# EAGLE design RaspiRobotBoardSMD (EAGLE 6.3)
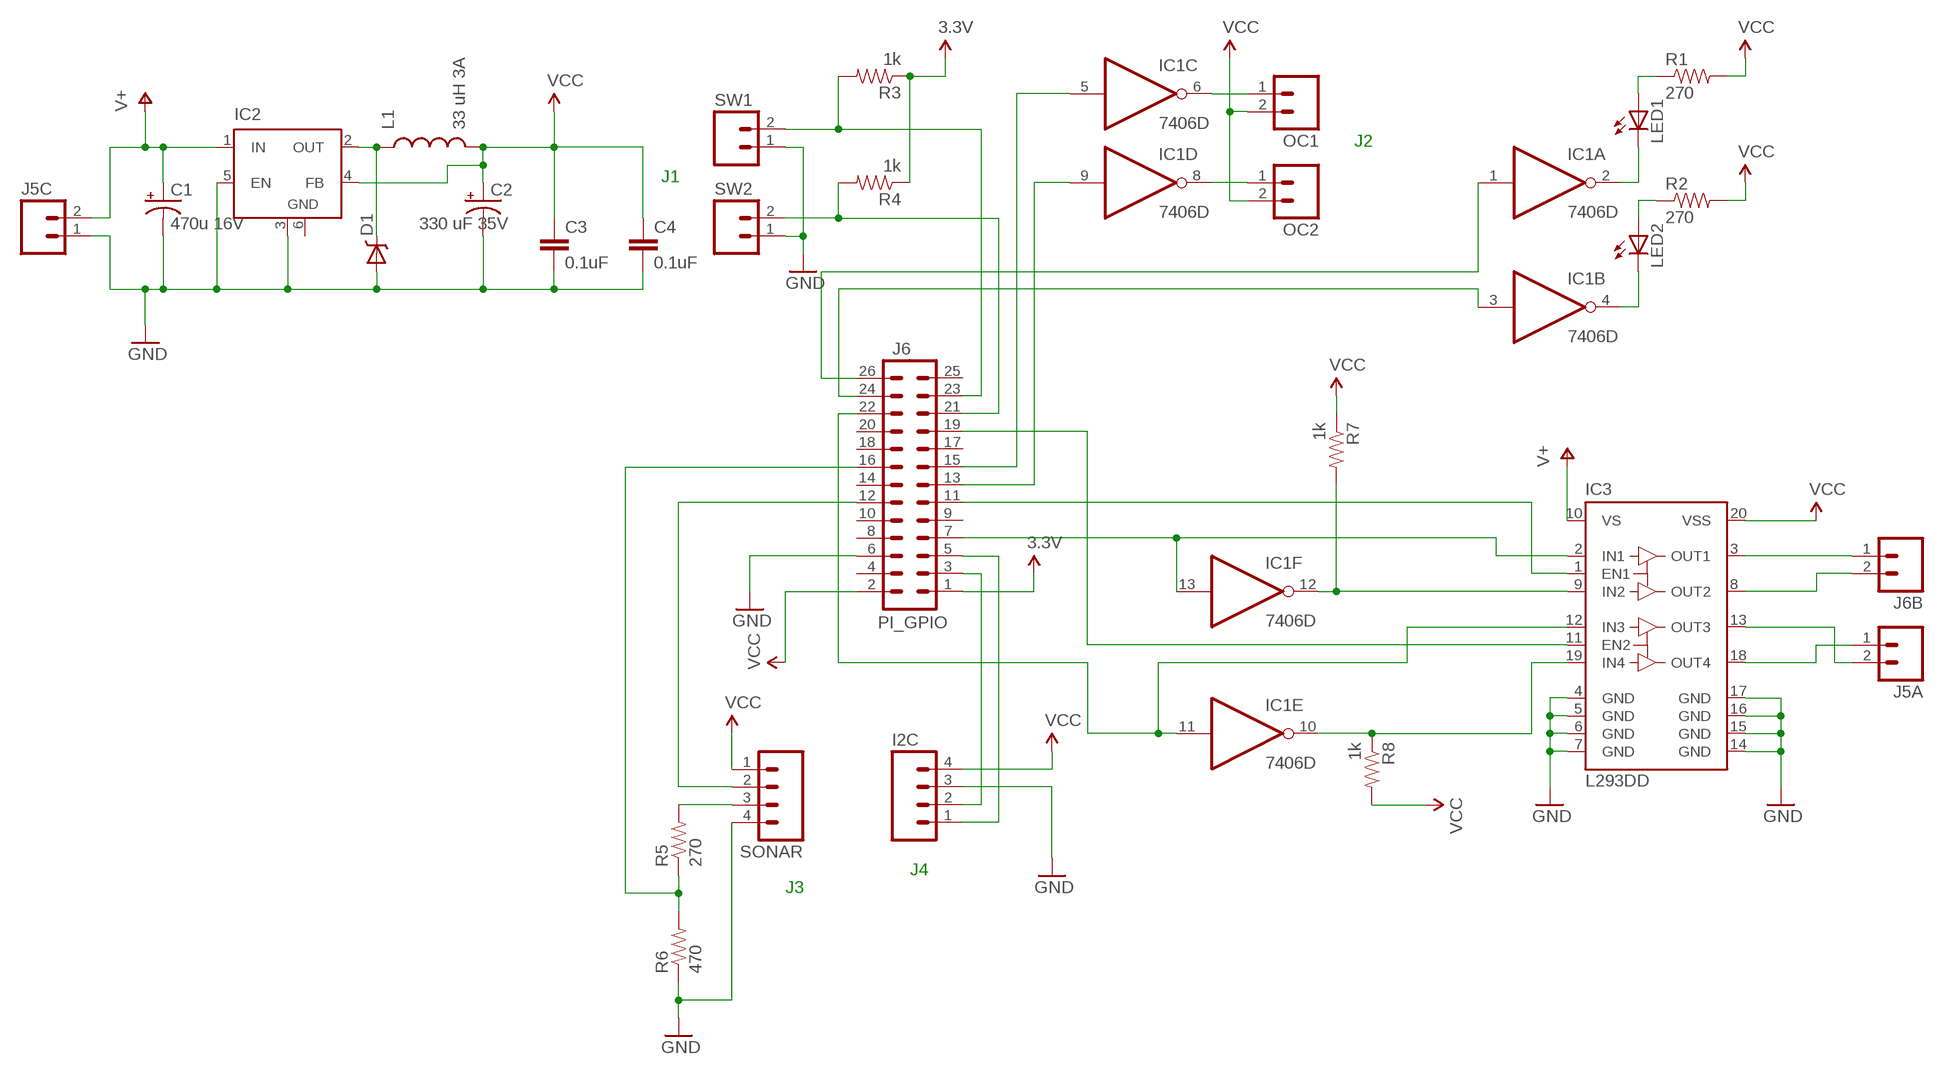
[diagram p0: schematic, sheet 1]

## Parts
C1  470u 16V  CAP_POLE  [PANASONIC_E]
C2  330 uF 35V  CAP_POLG  [PANASONIC_G]
C3  0.1uF  CAP0805  [0805]
C4  0.1uF  CAP0805  [0805]
D1  B340A  [SMA-DIODE]
I2C  M04PTH  [1X04]
IC1  7406D  [SO14]
IC2  LM2596S  [TO263-5]
IC3  L293DD  [SO20]
J5A  M023.5MM_LOCK  [SCREWTERMINAL-3.5MM-2_LOCK]
J5C  M023.5MM_LOCK  [SCREWTERMINAL-3.5MM-2_LOCK]
J6  M13X22X13  [2X13]
J6B  M023.5MM_LOCK  [SCREWTERMINAL-3.5MM-2_LOCK]
L1  33 uH 3A  INDUCTORPWR  [CDRH125]
LED1  LEDSMT1206  [1206]
LED2  LEDSMT1206  [1206]
OC1  M02PTH  [1X02]
OC2  M02PTH  [1X02]
R1  270  RESISTOR0805-RES  [0805]
R2  270  RESISTOR0805-RES  [0805]
R3  1k  RESISTOR0805-RES  [0805]
R4  1k  RESISTOR0805-RES  [0805]
R5  270  RESISTOR0805-RES  [0805]
R6  470  RESISTOR0805-RES  [0805]
R7  1k  RESISTOR0805-RES  [0805]
R8  1k  RESISTOR0805-RES  [0805]
SONAR  M04PTH  [1X04]
SW1  M02PTH  [1X02]
SW2  M02PTH  [1X02]

## Nets
3.3V: J6.1 R3.1 R4.1
GND [power]: C1.- C2.- C3.2 C4.2 D1.A I2C.3 IC2.3(GND) IC2.5(EN) IC3.4(GND) IC3.5(GND) IC3.6(GND) IC3.7(GND) IC3.14(GND) IC3.15(GND) IC3.16(GND) IC3.17(GND) J5C.1 J6.6 R6.1 SONAR.4 SW1.1 SW2.1
N$1: D1.C IC2.2(OUT) L1.1
N$2: IC3.3(OUT1) J6B.1
N$3: IC3.8(OUT2) J6B.2
N$4: IC3.18(OUT4) J5A.1
N$5: IC1.13(F:I) IC3.2(IN1) J6.7
N$6: IC1.12(F:O) IC3.9(IN2) R7.2
N$7: IC1.10(E:O) IC3.19(IN4) R8.1
N$8: IC1.11(E:I) IC3.12(IN3) J6.22
N$9: LED1.A R1.1
N$10: LED2.A R2.1
N$11: IC1.2(A:O) LED1.C
N$12: IC1.4(B:O) LED2.C
N$13: IC1.6(C:O) OC1.1
N$14: IC1.8(D:O) OC2.1
N$15: J6.23 R3.2 SW1.2
N$16: J6.21 R4.2 SW2.2
N$17: IC1.3(B:I) J6.24
N$18: J6.16 R5.1 R6.2
N$19: J6.12 SONAR.2
N$20: R5.2 SONAR.3
N$21: IC1.1(A:I) J6.26
N$22: IC3.1(EN1) J6.11
N$23: IC3.11(EN2) J6.19
N$24: IC1.9(D:I) J6.13
N$25: IC1.5(C:I) J6.15
N$26: I2C.2 J6.3
N$27: I2C.1 J6.5
N$28: IC3.13(OUT3) J5A.2
V+: C1.+ IC2.1(IN) IC3.10(VS) J5C.2
VCC: C2.+ C3.1 C4.1 I2C.4 IC2.4(FB) IC3.20(VSS) J6.2 L1.2 OC1.2 OC2.2 R1.2 R2.2 R7.1 R8.2 SONAR.1
Unconnected: J6.4 J6.8 J6.9 J6.10 J6.14 J6.17 J6.18 J6.20 J6.25

## Notes on the sheet
- J2
- J1
- PI_GPIO
- J4
- J3

## Power pins joined to a net without a drawn wire
GND: IC1.7(P:GND) IC2.6(GND)
VCC: IC1.14(P:VCC)

## Library data of the parts
C1 = MyParts:CAP_POL: Capacitor Polarized These are standard SMD and PTH capacitors. Normally 10uF, 47uF, and 100uF in electrolytic and tantalum varieties. Always verify the external diameter of the through hole cap, it varies with capacity, voltage, and manufacturer. The EIA devices should be standard.
C2 = SparkFun-Capacitors:CAP_POL: Capacitor Polarized These are standard SMD and PTH capacitors. Normally 10uF, 47uF, and 100uF in electrolytic and tantalum varieties. Always verify the external diameter of the through hole cap, it varies with capacity, voltage, and manufacturer. The EIA devices should be standard.
C3 C4 = SparkFun-Capacitors:CAP: Capacitor Standard 0603 ceramic capacitor, and 0.1" leaded capacitor.
D1 = SparkFun-DiscreteSemi:B340A: Schottky Diode 3A-40V; PROD_ID: DIO-09886
I2C SONAR = SparkFun-Connectors:M04: Header 4 Standard 4-pin 0.1" header. Use with straight break away headers (SKU : PRT-00116), right angle break away headers (PRT-00553), swiss pins (PRT-00743), machine pins (PRT-00117), and female headers (PRT-00115). Molex polarized connector foot print use with SKU : PRT-08231 with associated crimp pins and housings. 1MM SMD Version SKU: PRT-10208
IC1 = 74xx-eu:74*06: Hex INVERTER, open collector high-voltage output
IC2 = MyParts:LM2596S: STEP-DOWN VOLTAGE REGULATOR
IC3 = st-microelectronics:L293DD: PUSH-PULL FOUR CHANNEL DRIVER WITH DIODES Source: http://www.st.com/stonline/books/pdf/docs/1330.pdf; OC_FARNELL: unknown
J5A J5C J6B OC1 OC2 SW1 SW2 = SparkFun-Connectors:M02: Header 2 Standard 2-pin 0.1" header. Use with straight break away headers (SKU : PRT-00116), right angle break away headers (PRT-00553), swiss pins (PRT-00743), machine pins (PRT-00117), and female headers (PRT-00115). Molex polarized connector foot print use with SKU : PRT-08233 with associated crimp pins and housings.
J6 = SparkFun-Connectors:M13X2
L1 = SparkFun-Passives:INDUCTOR: Inductors Basic Inductor/Choke - 0603 and 1206. Footprints are not proven and vary greatly between part numbers.
LED1 LED2 = led:LED: LED OSRAM: - CHIPLED LG R971, LG N971, LY N971, LG Q971, LY Q971, LO R971, LY R971 LH N974, LH R974 LS Q976, LO Q976, LY Q976 LO Q996 - Hyper CHIPLED LW Q18S LB Q993, LB Q99A, LB R99A - SideLED LS A670, LO A670, LY A670, LG A670, LP A670 LB A673, LV A673, LT A673, LW A673 LH A674 LY A675 LS A676, LA A676, LO A676, LY A676, LW A676 LS A679, LY A679, LG A679 - Hyper Micro SIDELED® LS Y876, LA Y876, LO Y876, LY Y876 LT Y87S - SmartLED LW L88C, LW L88S LB L89C, LB L89S, LG L890 LS L89K, LO L89K, LY L89K LS L896, LA L896, LO L896, LY L896 - TOPLED LS T670, LO T670, LY T670, LG T670, LP T670 LSG T670, LSP T670, LSY T670, LOP T670, LYG T670 LG T671, LOG T671, LSG T671 LB T673, LV T673, LT T673, LW T673 LH T674 LS T676, LA T676, LO T676, LY T676, LB T676, LH T676, LSB T676, LW T676 LB T67C, LV T67C, LT T67C, LS T67K, LO T67K, LY T67K, LW E67C LS E67B, LA E67B, LO E67B, LY E67B, LB E67C, LV E67C, LT E67C LW T67C LS T679, LY T679, LG T679 LS T770, LO T770, LY T770, LG T770, LP T770 LB T773, LV T773, LT T773, LW T773 LH T774 LS E675, LA E675, LY E675, LS T675 LS T776, LA T776, LO T776, LY T776, LB T776 LHGB T686 LT T68C, LB T68C - Hyper Mini TOPLED® LB M676 - Mini TOPLED Santana® LG M470 LS M47K, LO M47K, LY M47K Source: http://www.osram.convergy.de LUXEON: - LUMILED® LXK2-PW12-R00, LXK2-PW12-S00, LXK2-PW14-U00, LXK2-PW14-V00 LXK2-PM12-R00, LXK2-PM12-S00, LXK2-PM14-U00 LXK2-PE12-Q00, LXK2-PE12-R00, LXK2-PE12-S00, LXK2-PE14-T00, LXK2-PE14-U00 LXK2-PB12-K00, LXK2-PB12-L00, LXK2-PB12-M00, LXK2-PB14-N00, LXK2-PB14-P00, LXK2-PB14-Q00 LXK2-PR12-L00, LXK2-PR12-M00, LXK2-PR14-Q00, LXK2-PR14-R00 LXK2-PD12-Q00, LXK2-PD12-R00, LXK2-PD12-S00 LXK2-PH12-R00, LXK2-PH12-S00 LXK2-PL12-P00, LXK2-PL12-Q00, LXK2-PL12-R00 Source: www.luxeon.com KINGBRIGHT: KA-3528ASYC Source: www.kingbright.com
R1-R8 = SparkFun-Resistors:RESISTOR: Resistor Basic schematic elements and footprints for 0603, 1206, and PTH resistors.

## Net classes
0 default: width 0.305 mm
1 power: width 0.305 mm

## Board
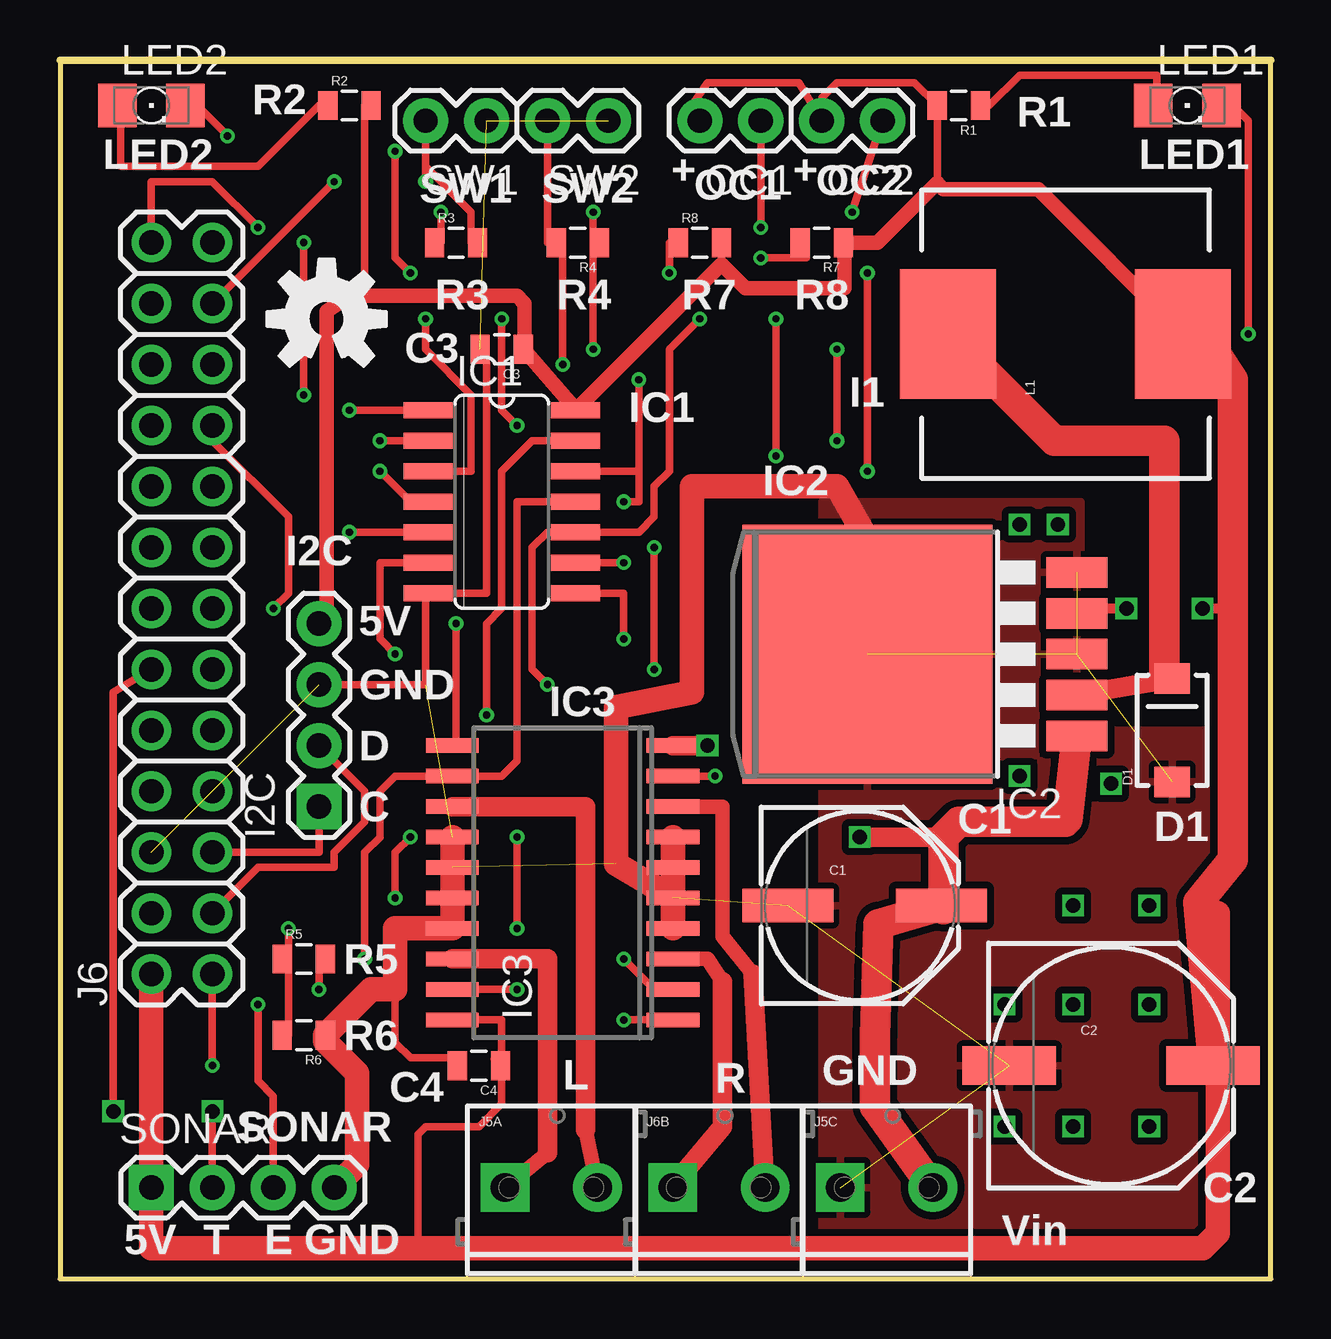
[diagram p1: board, top side]
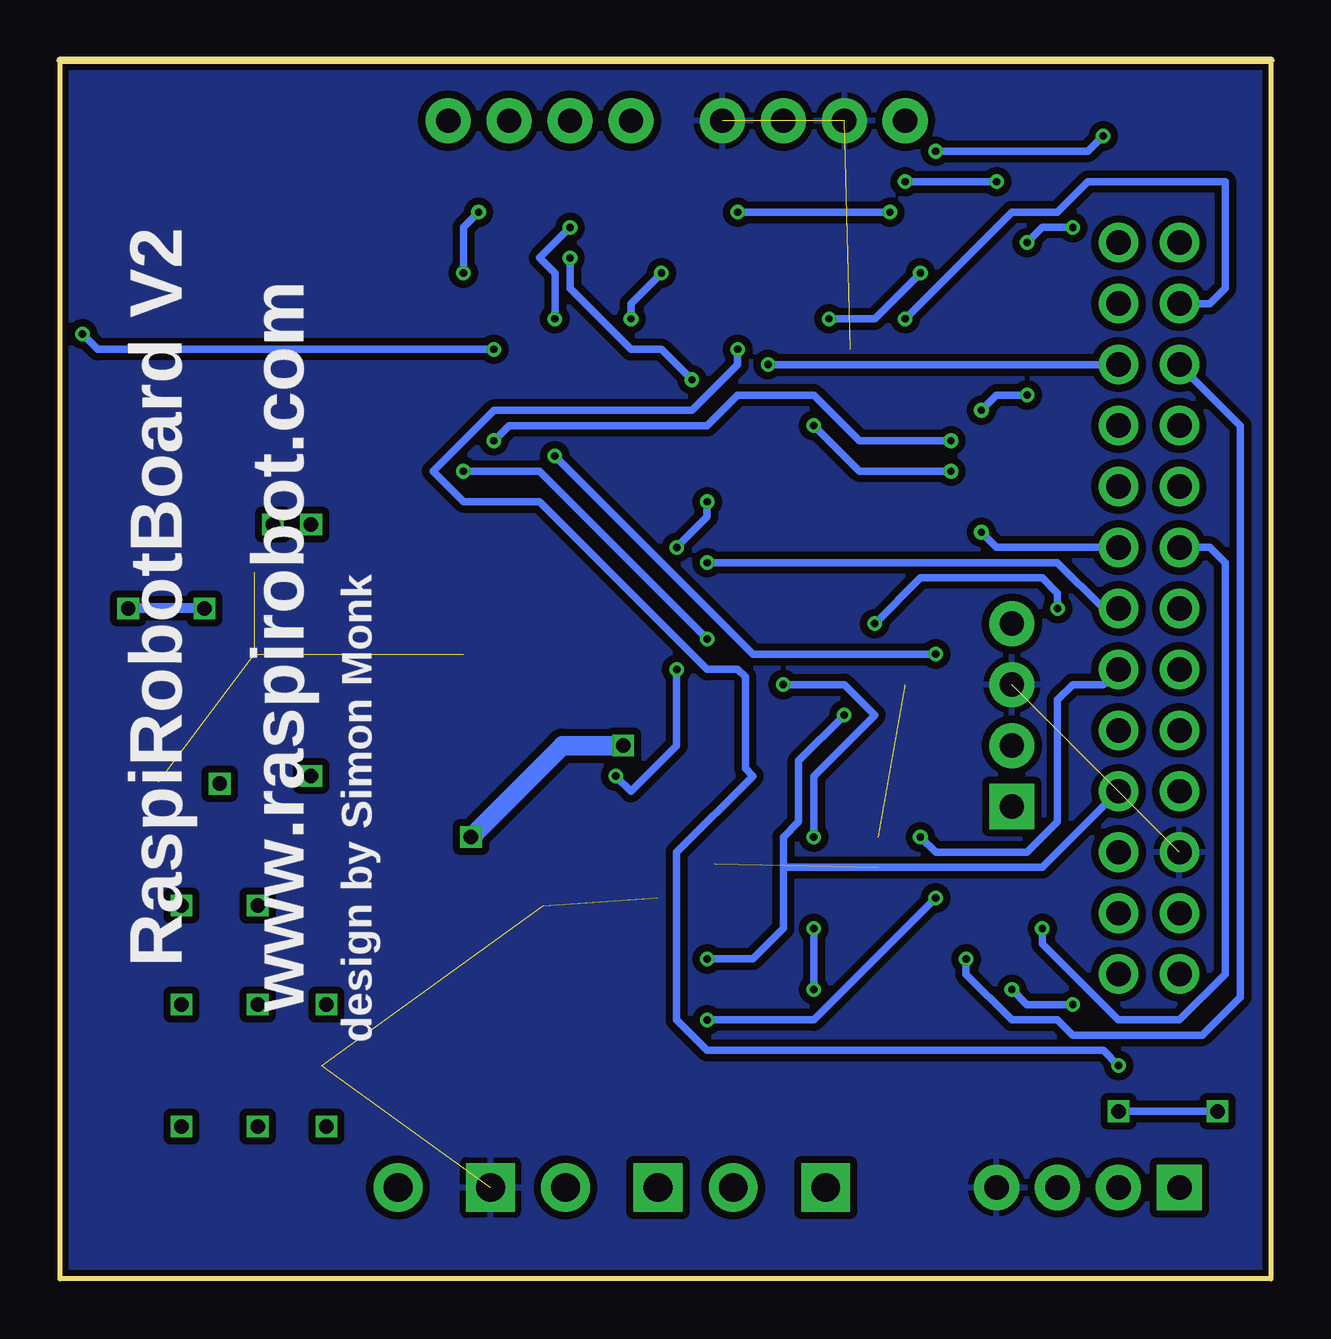
[diagram p2: board, bottom side, seen from below]

Size 50.47 x 50.79 mm. Coordinates in mm from the lower left corner, seen from the top.
Outline: 0,0 50.47,0 50.47,50.79 0,50.79 0,0
Copper layers (1*16): Top 0.035mm / dielectric 1.5mm / Bottom 0.035mm
Design rules "default": minimum track width 8mil, minimum drill 12mil, track to track 12mil, track to pad 12mil, pad to pad 12mil, via to via 12mil, smd to smd 0mil, copper to edge 10mil, drill to drill 10mil, minimum pad ring 10mil, minimum via ring 6mil, stop-mask expansion 2mil, vias tented up to drill 100mil, thermal gap 10mil

### Footprints (pad centres in the part's own frame; a part is rotated, then mirrored left to right if it is on the bottom)
PANASONIC_E = smd 3.8 x 1.4: + 3.4,0; - -3,0
PANASONIC_G = smd 3.9 x 1.6: + 4.25,0; - -4.25,0
0805 = smd 0.8 x 1.2: 1 -0.9,0; 2 0.9,0
SMA-DIODE = smd 1.27 x 1.47: A -2.15,0; C 2.15,0
1X04 = drill 1.016 pad 1.88 square: 1 0,0 | drill 1.016 pad 1.88: 2 2.54,0; 3 5.08,0; 4 7.62,0
SO14 = smd 0.66 x 2.032: 1 -3.81,-3.073; 2 -2.54,-3.073; 3 -1.27,-3.073; 4 0,-3.073; 5 1.27,-3.073; 6 2.54,-3.073; 7 3.81,-3.073; 8 3.81,3.073; 9 2.54,3.073; 10 1.27,3.073; 11 0,3.073; 12 -1.27,3.073; 13 -2.54,3.073; 14 -3.81,3.073
TO263-5 = smd 1.27 x 2.54: 1 -3.404,-6.191; 2 -1.702,-6.191; 3 0,-6.191; 4 1.702,-6.191; 5 3.404,-6.191 | smd 10.8 x 10.41: 6 0,2.54
SO20 = smd 0.6 x 2.2: 1 -5.715,-4.6; 2 -4.445,-4.6; 3 -3.175,-4.6; 4 -1.905,-4.6; 5 -0.635,-4.6; 6 0.635,-4.6; 7 1.905,-4.6; 8 3.175,-4.6; 9 4.445,-4.6; 10 5.715,-4.6; 11 5.715,4.6; 12 4.445,4.6; 13 3.175,4.6; 14 1.905,4.6; 15 0.635,4.6; 16 -0.635,4.6; 17 -1.905,4.6; 18 -3.175,4.6; 19 -4.445,4.6; 20 -5.715,4.6
SCREWTERMINAL-3.5MM-2_LOCK = drill 1.2 pad 2.032 square: 1 -0.178,0 | drill 1.2 pad 2.032: 2 3.678,0
2X13 = drill 1.016 pad 1.651: 1 0,0; 2 0,2.54; 3 2.54,0; 4 2.54,2.54; 5 5.08,0; 6 5.08,2.54; 7 7.62,0; 8 7.62,2.54; 9 10.16,0; 10 10.16,2.54; 11 12.7,0; 12 12.7,2.54; 13 15.24,0; 14 15.24,2.54; 15 17.78,0; 16 17.78,2.54; 17 20.32,0; 18 20.32,2.54; 19 22.86,0; 20 22.86,2.54; 21 25.4,0; 22 25.4,2.54; 23 27.94,0; 24 27.94,2.54; 25 30.48,0; 26 30.48,2.54
CDRH125 = smd 5.4 x 4: 1 0,4.9; 2 0,-4.9
1206 = smd 1.6 x 1.803: A -1.422,0; C 1.422,0
1X02 = drill 1.016 pad 1.88: 1 0,0; 2 2.54,0

### Placement (x,y rotation side)
C1  33.34,15.56 0 top
C2  43.81,8.89 0 top
C3  18.41,38.73 180 top
C4  17.46,8.89 180 top
D1  46.35,22.86 90 top
I2C  10.79,19.68 90 top
IC1  18.41,32.38 270 top
IC2  36.2,26.04 90 top
IC3  20.95,16.51 90 top
J5A  18.73,3.81 0 top
J5C  32.7,3.81 0 top
J6  6.35,12.7 90 top
J6B  25.72,3.81 0 top
L1  41.91,39.37 90 top
LED1  46.99,48.9 0 top
LED2  3.81,48.9 0 top
OC1  29.21,48.26 180 top
OC2  34.29,48.26 180 top
R1  37.47,48.9 180 top
R2  12.06,48.9 0 top
R3  16.51,43.18 0 top
R4  21.59,43.18 180 top
R5  10.16,13.34 0 top
R6  10.16,10.16 180 top
R7  31.75,43.18 180 top
R8  26.67,43.18 0 top
SONAR  3.81,3.81 0 top
SW1  17.78,48.26 180 top
SW2  22.86,48.26 180 top
U$1  [OSHW-LOGO-M]  11.11,40.01 0 top

### Tracks (layer width: path | path; a pad name or v marks a point on that pad's centre or on a via)
3.3V  (via drill 0.3)
  Top 0.305: v15.88,44.45 15.88,43.18 R3.1 | 22.23,43.18 v22.23,44.45 | v6.35,8.89 J6.1 | 22.23,43.18 v22.23,38.73 | 22.23,43.18 R4.1
  Bottom 0.305: v22.23,44.45 v15.88,44.45 | v6.35,8.89 6.99,9.53 23.5,9.53 24.77,10.79 24.77,17.78 21.59,20.95 21.91,21.27 21.91,25.08 22.23,25.4 23.5,25.4 30.48,32.38 33.66,32.38 34.92,33.66 32.38,36.2 24.13,36.2 22.23,38.1 v22.23,38.73
GND  (11 unrouted)
  Top 0.305: C3.2 17.78,38.15 17.78,28.57 IC1.7 15.24,28.47 15.24,24.77 I2C.3 | C4.2 16.25,9.21 14.61,9.21 13.97,9.84 13.97,12.06
  Top 1.016: SONAR.4 12.38,4.76 12.38,8.57 11.06,9.89 R6.1 12.96,12.06 13.97,12.06 13.97,14.61 IC3.17 IC3.16 IC3.15 IC3.14 | IC3.4 IC3.5 | IC3.5 IC3.6 IC3.7 | IC3.5 23.18,17.3 23.18,23.81 26.35,24.45 26.35,33.02 32.38,33.02 33.66,30.8 IC2.6
  pour Bottom: 0,50.8 50.8,50.8 50.8,0 0,0
  pour Top: 31.75,0 31.75,32.38 42.55,32.38 42.55,22.86 50.16,22.86 50.16,0
N$1
  Top 0.813: IC2.2 D1.C
  Top 1.27: L1.1 41.45,34.92 46.04,34.92 46.04,25.01 D1.C
N$2
  Top 0.61: IC3.3 26.99,13.34 27.62,12.38 | 25.86,4.27 J6B.1
  Top 0.813: 27.62,12.38 27.62,6.35 25.86,4.27
N$3
  Top 0.61: IC3.8 27.62,19.68 27.62,14.29 28.89,12.7
  Top 0.813: 28.89,12.7 J6B.2
N$4
  Top 0.61: J5A.1 20.32,5.26
  Top 0.813: 20.32,5.26 20.32,13.34 IC3.18
N$5  (via drill 0.3)
  Top 0.305: IC1.13 19.68,34.92 18.41,33.66 18.41,27.94 17.78,27.3 v17.78,23.5 | v23.5,13.34 24.77,12.06 IC3.2
  Bottom 0.305: v17.78,23.5 19.68,21.59 19.68,19.05 20.32,18.41 20.32,17.14 | v23.5,13.34 21.59,13.34 20.32,14.61 20.32,17.14 | J6.7 9.53,17.14 20.32,17.14
N$6  (via drill 0.3)
  Top 0.305: 24.13,33.66 IC1.12 | v24.13,37.47 24.13,33.66 | v29.21,42.55 31.11,42.55 31.11,43.18 R7.2 | v27.3,20.95 IC3.9 | v24.77,30.48 v24.77,25.4 | v23.5,32.38 24.13,32.38 24.13,33.66
  Bottom 0.305: v24.13,37.47 25.4,38.73 26.67,38.73 29.21,41.27 v29.21,42.55 | v27.3,20.95 26.67,20.32 24.77,22.23 v24.77,25.4 | v24.77,30.48 23.5,31.75 v23.5,32.38
N$7  (via drill 0.3)
  Top 0.305: v25.4,41.91 25.4,43.18 R8.1 | v26.67,40.01 25.4,38.73 25.4,33.66 24.77,33.02 24.77,31.75 24.13,31.11 IC1.10 20.32,31.11 19.68,30.48 19.68,25.4 v20.32,24.77 | v19.05,12.06 IC3.19 | v19.05,18.41 v19.05,14.61
  Bottom 0.305: v25.4,41.91 26.67,40.64 v26.67,40.01 | v19.05,14.61 v19.05,12.06 | v19.05,18.41 19.05,20.95 16.51,23.5 17.78,24.77 v20.32,24.77
N$8  (via drill 0.3)
  Top 0.305: IC1.11 19.05,32.38 19.05,21.59 18.41,20.95 IC3.12 13.97,20.95 13.34,20.32 13.34,18.41 12.7,17.78 v12.7,13.34
  Bottom 0.305: v12.7,13.34 12.7,12.7 10.79,10.79 8.89,10.79 8.26,10.16 2.86,10.16 1.27,11.75 1.27,35.56 J6.22
N$9
  Top 0.305: R1.1 38.73,48.9 40.01,50.16 45.72,50.16 45.72,48.9 LED1.A
N$10
  Top 0.305: R2.1 10.79,48.9 8.26,46.35 2.54,46.35 2.54,48.9 LED2.A
N$11  (via drill 0.3)
  Top 0.305: v49.53,39.37 49.53,48.26 48.9,48.9 LED1.C | v32.38,34.92 v32.38,38.73 | IC1.2 v13.34,34.92
  Bottom 0.305: v49.53,39.37 48.9,38.73 v32.38,38.73 | v32.38,34.92 31.75,35.56 23.5,35.56 22.23,36.83 19.05,36.83 17.14,34.92 v13.34,34.92
N$12  (via drill 0.3)
  Top 0.305: v6.99,47.62 5.71,48.9 LED2.C | v13.97,46.99 13.97,42.55 v14.61,41.91 | v18.41,40.01 18.41,36.2 v19.05,35.56 | v13.34,33.66 14.61,32.38 IC1.4
  Bottom 0.305: v6.99,47.62 7.62,46.99 v13.97,46.99 | v14.61,41.91 16.51,40.01 v18.41,40.01 | v19.05,35.56 17.14,33.66 v13.34,33.66
N$13  (via drill 0.3)
  Top 0.305: IC1.6 13.34,29.84 13.34,26.67 v13.97,26.04 | v29.84,40.01 v29.84,34.29 | OC1.1 v29.21,43.81
  Bottom 0.305: v13.97,26.04 21.59,26.04 v29.84,34.29 | v29.84,40.01 29.84,41.91 30.48,42.55 v29.21,43.81
N$14  (via drill 0.3)
  Top 0.305: IC1.8 23.5,28.57 v23.5,26.67 | v33.66,41.91 v33.66,33.66 | OC2.1 v33.02,44.45
  Bottom 0.305: v23.5,26.67 30.48,33.66 v33.66,33.66 | v33.66,41.91 33.66,43.81 v33.02,44.45
N$15  (via drill 0.3)
  Top 0.305: 15.24,46.35 17.14,44.45 17.14,43.18 R3.2 | SW1.2 15.24,46.35 | v11.43,45.72 J6.23 | 15.24,46.35 v15.24,45.72
  Bottom 0.305: v15.24,45.72 v11.43,45.72
N$16  (via drill 0.3)
  Top 0.305: SW2.2 20.32,43.18 R4.2 20.95,43.18 v20.95,38.1
  Bottom 0.305: v20.95,38.1 J6.21
N$17  (via drill 0.3)
  Top 0.305: IC1.3 17.14,33.66 17.14,36.83 15.24,38.73 v15.24,40.01
  Bottom 0.305: v15.24,40.01 10.79,44.45 8.89,44.45 7.62,45.72 1.91,45.72 1.91,41.27 2.54,40.64 J6.24
N$18  (via drill 0.3)
  Top 0.305: 9.53,13.34 9.53,10.16 R6.2 | v9.53,14.61 9.53,13.34 | 9.53,13.34 R5.1
  Bottom 0.305: v9.53,14.61 9.53,13.97 6.35,10.79 3.81,10.79 1.91,12.7 1.91,29.84 2.54,30.48 J6.16
N$19  (via drill 0.6)
  Top 0.305: SONAR.2 v6.35,6.99 | v2.22,6.99 2.22,24.45 J6.12
  Bottom 0.305: v6.35,6.99 v2.22,6.99
N$20  (via drill 0.3)
  Top 0.305: v10.79,12.06 10.79,13.34 R5.2 | v8.26,11.43 8.26,8.26 8.89,7.62 SONAR.3
  Bottom 0.305: v10.79,12.06 10.16,11.43 v8.26,11.43
N$21  (via drill 0.3)
  Top 0.305: v12.06,36.2 IC1.1 | v10.16,43.18 v10.16,36.83 | v8.26,43.81 6.35,45.72 3.81,45.72 J6.26
  Bottom 0.305: v12.06,36.2 11.43,36.83 v10.16,36.83 | v10.16,43.18 9.53,43.81 v8.26,43.81
N$22  (via drill 0.3)
  Top 0.305: v23.5,10.79 IC3.1 | v13.97,15.88 13.97,17.78 v14.61,18.41
  Bottom 0.305: v23.5,10.79 19.05,10.79 v13.97,15.88 | v14.61,18.41 13.97,17.78 10.16,17.78 8.89,19.05 8.89,24.13 8.26,24.77 6.99,24.77 J6.11
N$23  (via drill 0.3)
  Top 0.305: v16.51,27.3 16.51,22.23 IC3.11 | v8.89,27.94 9.53,28.57 9.53,31.75 6.35,34.92 J6.19
  Bottom 0.305: v16.51,27.3 14.61,29.21 9.53,29.21 8.89,28.57 v8.89,27.94
N$24  (via drill 0.3)
  Top 0.305: v23.5,29.84 IC1.9
  Bottom 0.305: v23.5,29.84 8.89,29.84 6.99,27.94 J6.13
N$25  (via drill 0.3)
  Top 0.305: v12.06,31.11 IC1.5
  Bottom 0.305: v12.06,31.11 11.43,30.48 J6.15
N$26
  Top 0.305: J6.3 8.26,17.14 11.43,17.14 11.43,17.78 12.7,19.05 12.7,20.32 11.43,21.59 10.79,21.59 I2C.2
N$27
  Top 0.305: J6.5 10.79,17.78 I2C.1
N$28
  Top 0.61: J5A.2 21.91,6.22
  Top 0.813: 21.91,6.22 21.91,19.68 IC3.13
N$29  (via drill 0.6)
  other vias: 40.01,31.43
N$30  (via drill 0.6)
  other vias: 43.81,20.64
N$31  (via drill 0.6)
  other vias: 41.59,31.43
N$32  (via drill 0.6)
  other vias: 40.01,20.95
N$33  (via drill 0.6)
  other vias: 39.37,11.43
N$34  (via drill 0.6)
  other vias: 45.4,11.43
N$35  (via drill 0.6)
  other vias: 42.23,11.43
N$36  (via drill 0.6)
  other vias: 42.23,15.56
N$37  (via drill 0.6)
  other vias: 45.4,15.56
N$38  (via drill 0.6)
  other vias: 39.37,6.35
N$39  (via drill 0.6)
  other vias: 42.23,6.35
N$40  (via drill 0.6)
  other vias: 45.4,6.35
V+  (via drill 0.6)
  Top 0.813: 36.83,18.41 v33.34,18.41 | v26.99,22.23 IC3.10
  Top 1.27: J5C.2 33.97,7.17 33.97,10.16 34.12,14.78 C1.+ 36.83,15.41 36.83,18.41 37.47,19.05 41.91,19.05 41.99,19.13 IC2.1
  Bottom 0.813: v33.34,18.41 29.53,22.23 v26.99,22.23
VCC  (via drill 0.6)
  Top 0.305: 21.49,36.24 IC1.14 | 14.92,1.27 14.92,6.03 15.24,6.35 17.46,6.35 18.41,7.3 18.41,8.84 C4.1 18.1,9.15 18.41,9.47 18.41,10.79 IC3.20 | 36.56,45.67 R1.2 35.61,49.85 32.38,49.85 31.75,49.21 OC2.2 30.8,49.85 26.99,49.85 26.35,48.9 OC1.2 | R7.1 32.7,43.13 | 27.57,42.28 R8.2 27.57,42.28 | R2.2 12.7,48.9 12.7,41.27 12.06,40.64 11.92,40.86
  Top 0.406: IC2.4 42.19,27.94 v44.45,27.94 | v47.62,27.94 48.9,27.94
  Top 0.61: 21.49,36.24 C3.1 19.37,38.47 19.37,40.64 19.05,40.96 12.06,40.96 11.92,40.86 11.11,40.32 11.11,27.94 I2C.4 | L1.2 40.78,45.4 36.83,45.4 36.56,45.67 34.08,43.18 R7.1 | 32.7,43.13 32.7,41.27 28.57,41.27 27.57,42.28 | IC1.14 27.57,42.28
  Top 1.016: J6.2 SONAR.1 3.81,1.27 14.92,1.27 47.62,1.27 48.26,1.91 48.26,15.24 C2.+
  Top 1.27: C2.+ 47.45,15.7 48.9,17.46 48.9,27.94 48.9,37.47 47.62,39.37 L1.2
  Bottom 0.406: v44.45,27.94 v47.62,27.94

### Text on the board
tPlace: R2 | R1 | LED2 | + | + | LED1 | SW1 | SW2 | OC1 | OC2 | R3 | R4 | R7 | R8 | C3 | IC1 | I1 | IC2 | I2C | 5V | GND | IC3 | D | C | C1 | D1 | R5 | R6 | L | R | GND | C4 | SONAR | C2 | 5V | T | E | GND | Vin
bPlace: RaspiRobotBoard V2 | www.raspirobot.com | design by Simon Monk